# EAGLE board XMICRO-6502 V2.4 (EAGLE 6.3), part 1 of 2
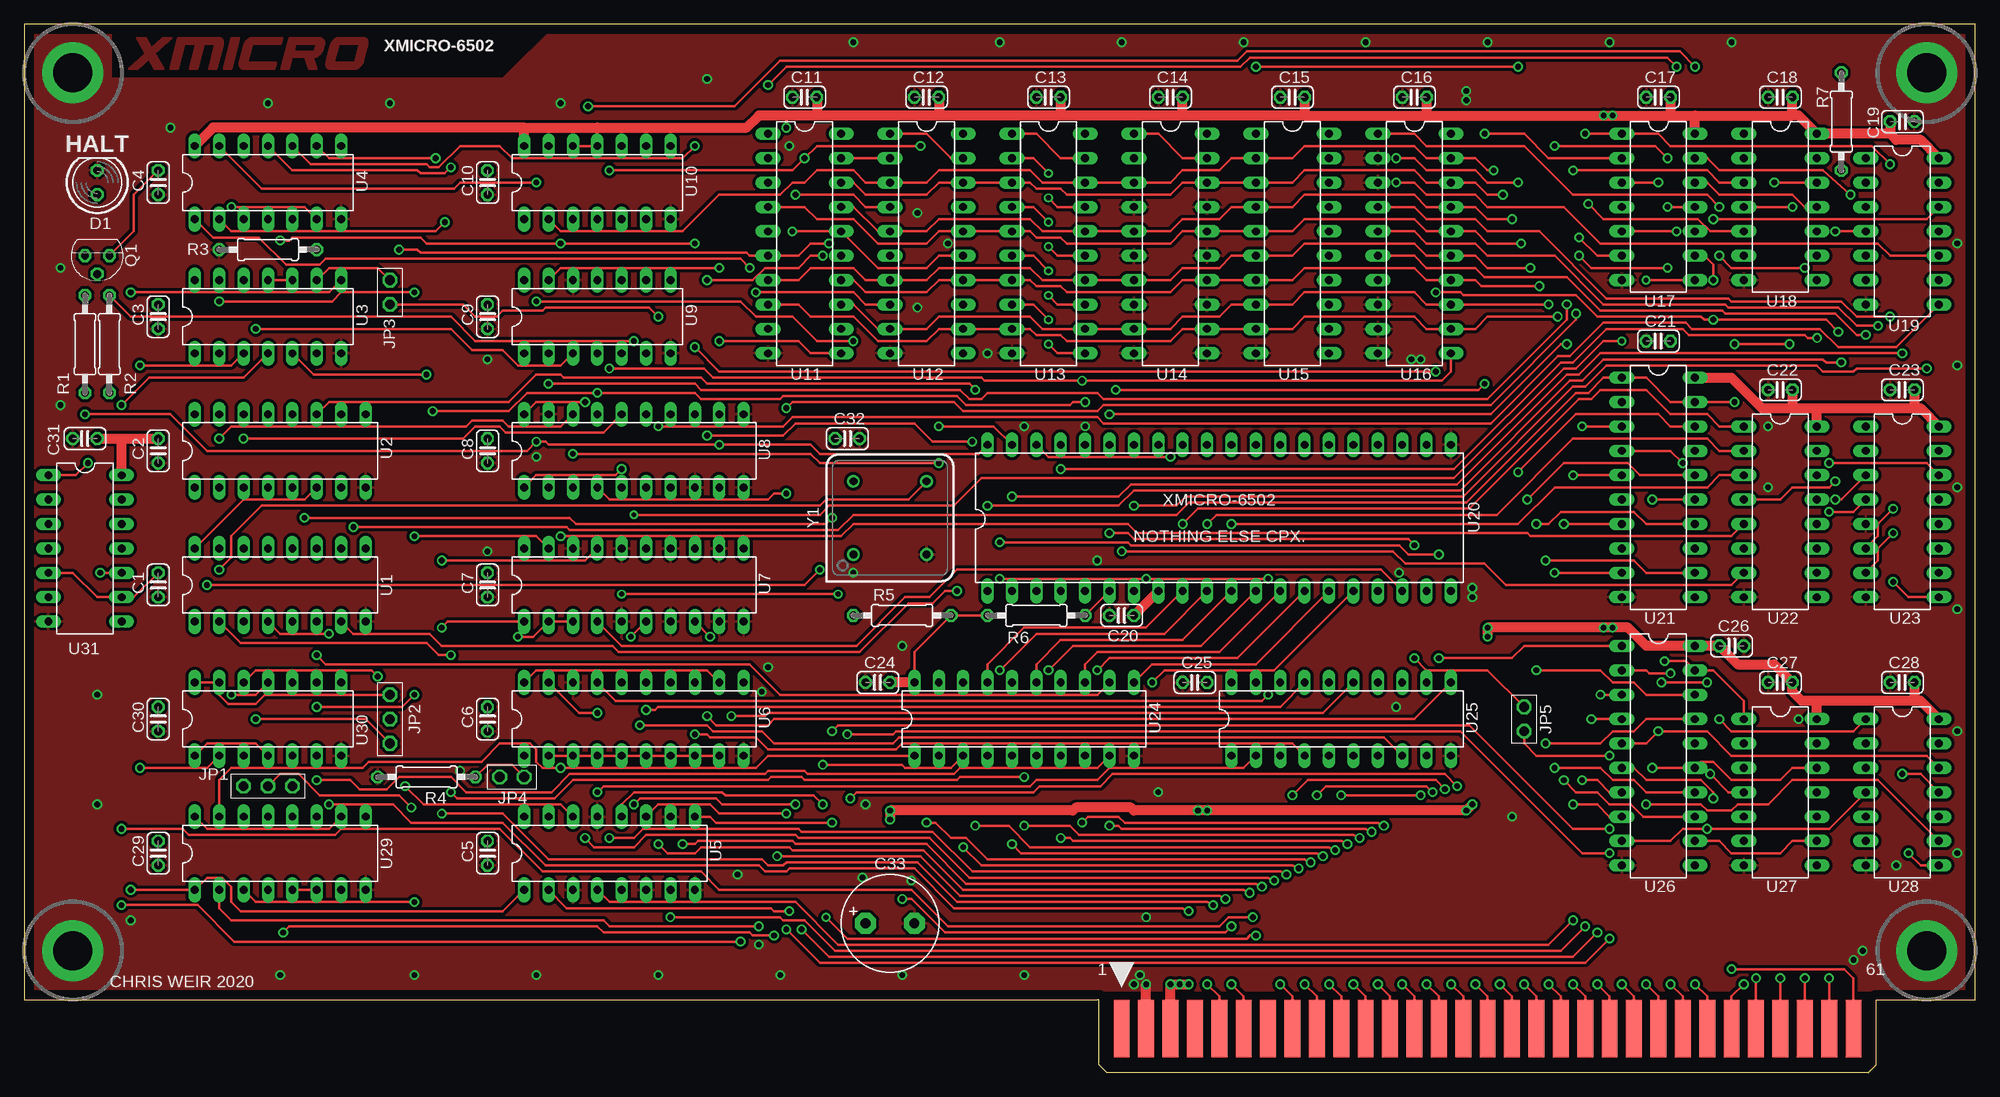
[diagram p6: board, top side]
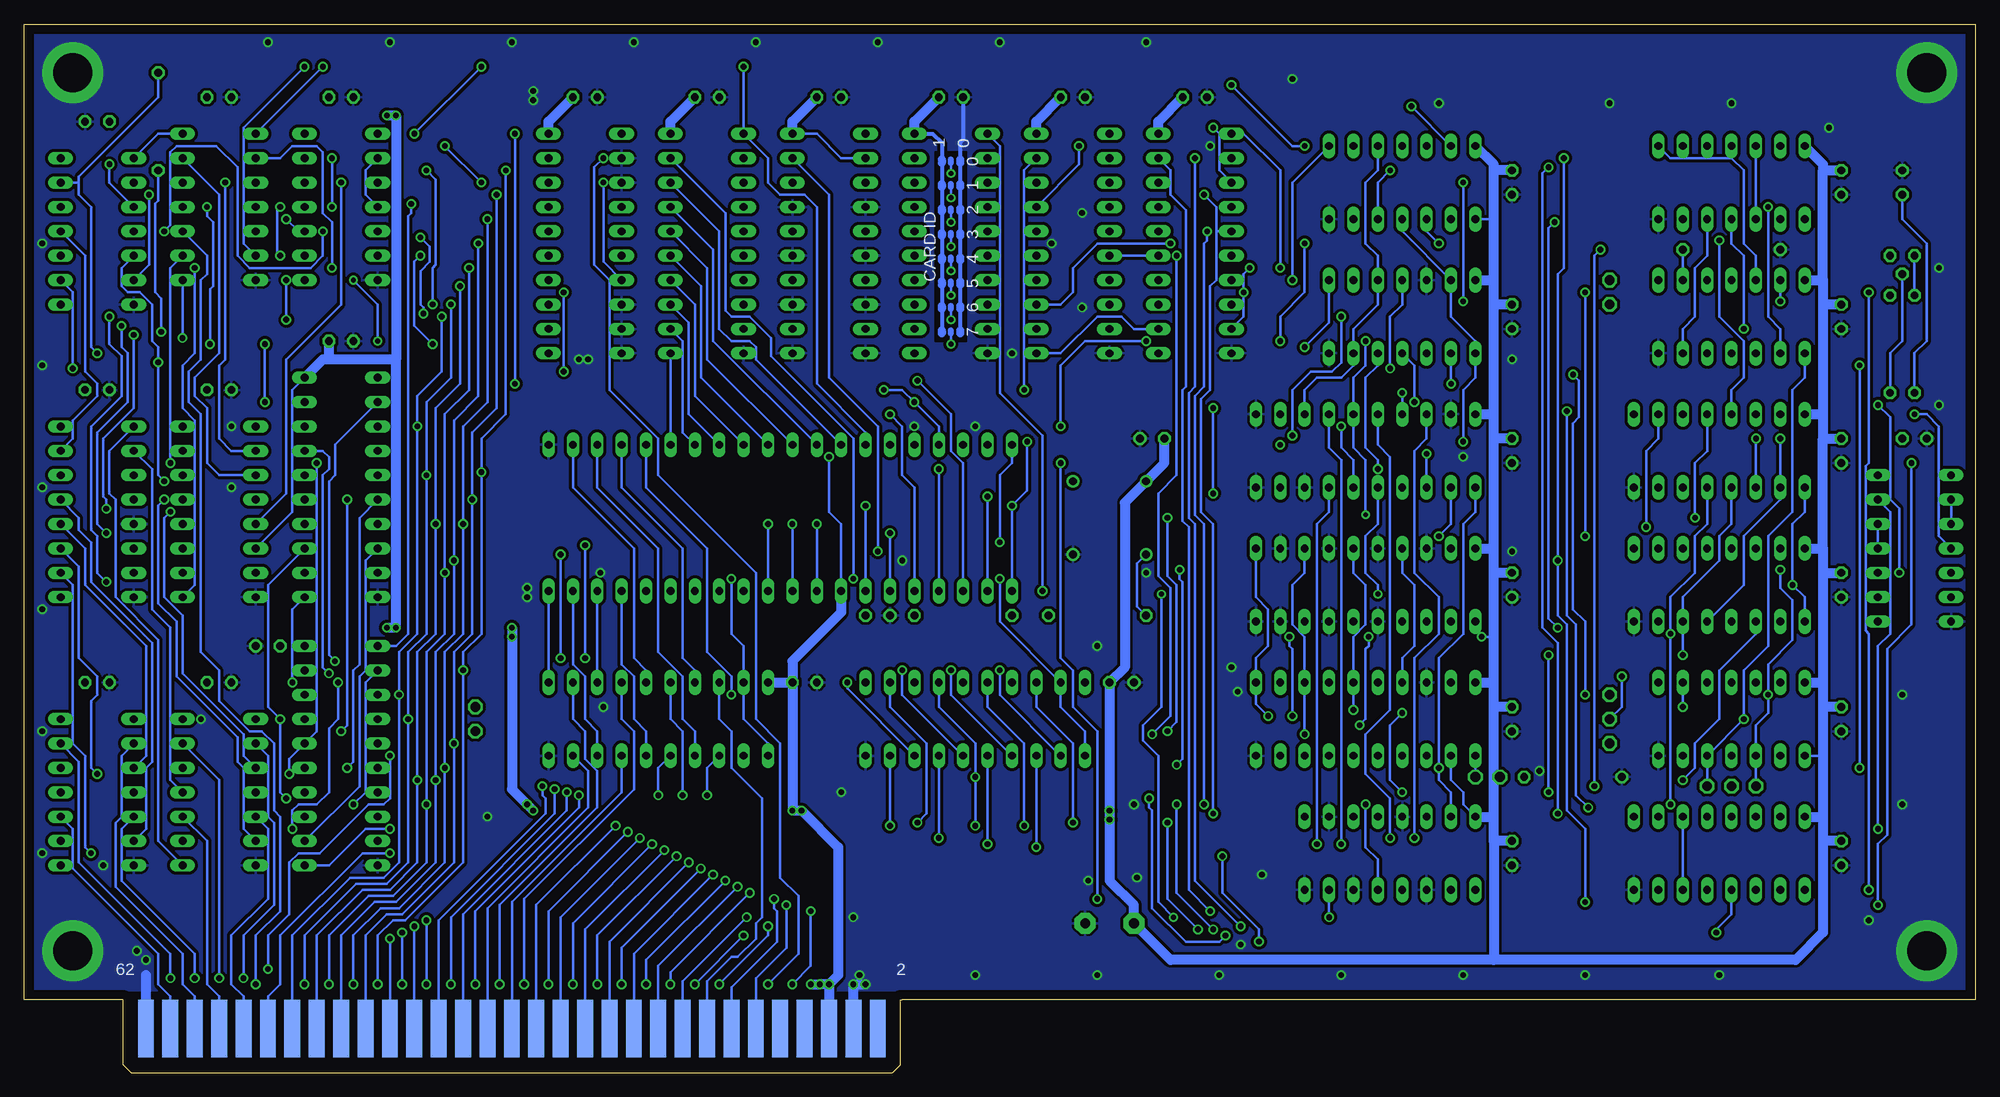
[diagram p7: board, bottom side, seen from below]

Size 203.2 x 109.22 mm. Coordinates in mm from the lower left corner, seen from the top.
Outline: 111.76,7.62 0,7.62 0,109.22 203.2,109.22 203.2,7.62 193.04,7.62
Copper layers (1*16): Top 0.035mm / dielectric 1.5mm / Bottom 0.035mm
Design rules "default *": minimum track width 10mil, minimum drill 0.3mm, track to track 10mil, track to pad 10mil, pad to pad 10mil, via to via 10mil, smd to smd 10mil, copper to edge 40mil, drill to drill 10mil, minimum pad ring 10mil, minimum via ring 8mil, stop-mask expansion 4mil, vias tented up to drill 100mil, thermal gap 10mil
Net classes: 1 GND: width 0.254 mm, clearance 0.305 mm
bRestrict: area 105.1,76.2 to 108.3,95.9

## Footprints (pad centres in the part's own frame; a part is rotated, then mirrored left to right if it is on the bottom)
C025-024X044 = drill 0.813 octagon: 1 -1.27,0; 2 1.27,0
C-10-5 = drill 1.016 pad 2.184 octagon: + -2.54,0; - 2.54,0
LED5MM = drill 0.813 octagon: A -1.27,0; K 1.27,0
1X03 = drill 1.016 octagon: 1 -2.54,0; 2 0,0; 3 2.54,0
1X02 = drill 1.016 octagon: 1 -1.27,0; 2 1.27,0
EDGE62M = smd 1.651 x 5.969: 1 -38.1,-3.01; 3 -35.56,-3.01; 5 -33.02,-3.01; 7 -30.48,-3.01; 9 -27.94,-3.01; 11 -25.4,-3.01; 13 -22.86,-3.01; 15 -20.32,-3.01; 17 -17.78,-3.01; 19 -15.24,-3.01; 21 -12.7,-3.01; 23 -10.16,-3.01; 25 -7.62,-3.01; 27 -5.08,-3.01; 29 -2.54,-3.01; 31 0,-3.01; 33 2.54,-3.01; 35 5.08,-3.01; 37 7.62,-3.01; 39 10.16,-3.01; 41 12.7,-3.01; 43 15.24,-3.01; 45 17.78,-3.01; 47 20.32,-3.01; 49 22.86,-3.01; 51 25.4,-3.01; 53 27.94,-3.01; 55 30.48,-3.01; 57 33.02,-3.01; 59 35.56,-3.01; 61 38.1,-3.01 | smd 1.651 x 5.969 bottom: 2 -38.1,-3.01; 4 -35.56,-3.01; 6 -33.02,-3.01; 8 -30.48,-3.01; 10 -27.94,-3.01; 12 -25.4,-3.01; 14 -22.86,-3.01; 16 -20.32,-3.01; 18 -17.78,-3.01; 20 -15.24,-3.01; 22 -12.7,-3.01; 24 -10.16,-3.01; 26 -7.62,-3.01; 28 -5.08,-3.01; 30 -2.54,-3.01; 32 0,-3.01; 34 2.54,-3.01; 36 5.08,-3.01; 38 7.62,-3.01; 40 10.16,-3.01; 42 12.7,-3.01; 44 15.24,-3.01; 46 17.78,-3.01; 48 20.32,-3.01; 50 22.86,-3.01; 52 25.4,-3.01; 54 27.94,-3.01; 56 30.48,-3.01; 58 33.02,-3.01; 60 35.56,-3.01; 62 38.1,-3.01
TO92 = drill 0.813 octagon: 1 -1.27,0; 2 0,1.905; 3 1.27,0
0207/10 = drill 0.813 octagon: 1 -5.08,0; 2 5.08,0
DIL16 = drill 0.813 long: 1 -8.89,-3.81; 2 -6.35,-3.81; 3 -3.81,-3.81; 4 -1.27,-3.81; 5 1.27,-3.81; 6 3.81,-3.81; 7 6.35,-3.81; 8 8.89,-3.81; 9 8.89,3.81; 10 6.35,3.81; 11 3.81,3.81; 12 1.27,3.81; 13 -1.27,3.81; 14 -3.81,3.81; 15 -6.35,3.81; 16 -8.89,3.81
DIL14 = drill 0.813 long: 1 -7.62,-3.81; 2 -5.08,-3.81; 3 -2.54,-3.81; 4 0,-3.81; 5 2.54,-3.81; 6 5.08,-3.81; 7 7.62,-3.81; 8 7.62,3.81; 9 5.08,3.81; 10 2.54,3.81; 11 0,3.81; 12 -2.54,3.81; 13 -5.08,3.81; 14 -7.62,3.81
DIL20 = drill 0.813 long: 1 -11.43,-3.81; 2 -8.89,-3.81; 3 -6.35,-3.81; 4 -3.81,-3.81; 5 -1.27,-3.81; 6 1.27,-3.81; 7 3.81,-3.81; 8 6.35,-3.81; 9 8.89,-3.81; 10 11.43,-3.81; 11 11.43,3.81; 12 8.89,3.81; 13 6.35,3.81; 14 3.81,3.81; 15 1.27,3.81; 16 -1.27,3.81; 17 -3.81,3.81; 18 -6.35,3.81; 19 -8.89,3.81; 20 -11.43,3.81
DIL40 = drill 0.813 long: 1 -24.13,-7.62; 2 -21.59,-7.62; 3 -19.05,-7.62; 4 -16.51,-7.62; 5 -13.97,-7.62; 6 -11.43,-7.62; 7 -8.89,-7.62; 8 -6.35,-7.62; 9 -3.81,-7.62; 10 -1.27,-7.62; 11 1.27,-7.62; 12 3.81,-7.62; 13 6.35,-7.62; 14 8.89,-7.62; 15 11.43,-7.62; 16 13.97,-7.62; 17 16.51,-7.62; 18 19.05,-7.62; 19 21.59,-7.62; 20 24.13,-7.62; 21 24.13,7.62; 22 21.59,7.62; 23 19.05,7.62; 24 16.51,7.62; 25 13.97,7.62; 26 11.43,7.62; 27 8.89,7.62; 28 6.35,7.62; 29 3.81,7.62; 30 1.27,7.62; 31 -1.27,7.62; 32 -3.81,7.62; 33 -6.35,7.62; 34 -8.89,7.62; 35 -11.43,7.62; 36 -13.97,7.62; 37 -16.51,7.62; 38 -19.05,7.62; 39 -21.59,7.62; 40 -24.13,7.62
DIL08S = drill 0.813: 1 -3.81,-3.81; 4 3.81,-3.81; 5 3.81,3.81; 8 -3.81,3.81

## Placement (x,y rotation side)
C1  0.1uF  [C025-024X044]  13.97,50.8 270 top
C2  0.1uF  [C025-024X044]  13.97,64.77 270 top
C3  0.1uF  [C025-024X044]  13.97,78.74 270 top
C4  0.1uF  [C025-024X044]  13.97,92.71 270 top
C5  0.1uF  [C025-024X044]  48.26,22.86 270 top
C6  0.1uF  [C025-024X044]  48.26,36.83 270 top
C7  0.1uF  [C025-024X044]  48.26,50.8 270 top
C8  0.1uF  [C025-024X044]  48.26,64.77 270 top
C9  0.1uF  [C025-024X044]  48.26,78.74 270 top
C10  0.1uF  [C025-024X044]  48.26,92.71 270 top
C11  0.1uF  [C025-024X044]  81.28,101.6 180 top
C12  0.1uF  [C025-024X044]  93.98,101.6 180 top
C13  0.1uF  [C025-024X044]  106.68,101.6 180 top
C14  0.1uF  [C025-024X044]  119.38,101.6 180 top
C15  0.1uF  [C025-024X044]  132.08,101.6 180 top
C16  0.1uF  [C025-024X044]  144.78,101.6 180 top
C17  0.1uF  [C025-024X044]  170.18,101.6 180 top
C18  0.1uF  [C025-024X044]  182.88,101.6 180 top
C19  0.1uF  [C025-024X044]  195.58,99.06 0 top
C20  0.1uF  [C025-024X044]  114.3,47.62 180 top
C21  0.1uF  [C025-024X044]  170.18,76.2 180 top
C22  0.1uF  [C025-024X044]  182.88,71.12 180 top
C23  0.1uF  [C025-024X044]  195.58,71.12 180 top
C24  0.1uF  [C025-024X044]  88.9,40.64 180 top
C25  0.1uF  [C025-024X044]  121.92,40.64 180 top
C26  0.1uF  [C025-024X044]  177.8,44.45 0 top
C27  0.1uF  [C025-024X044]  182.88,40.64 180 top
C28  0.1uF  [C025-024X044]  195.58,40.64 180 top
C29  0.1uF  [C025-024X044]  13.97,22.86 270 top
C30  0.1uF  [C025-024X044]  13.97,36.83 270 top
C31  0.1uF  [C025-024X044]  6.35,66.04 180 top
C32  0.1uF  [C025-024X044]  85.72,66.04 0 top
C33  470uF  [C-10-5]  90.17,15.56 0 top
D1  RED  [LED5MM]  7.62,92.71 90 top
JP1  PINHD1X3THRU  [1X03]  25.4,29.85 180 top
JP2  PINHD1X3THRU  [1X03]  38.1,36.83 270 top
JP3  PINHD-1X2THRU  [1X02]  38.1,81.28 270 top
JP4  PINHD-1X2THRU  [1X02]  50.8,30.8 0 top
JP5  PINHD-1X2THRU  [1X02]  156.21,36.83 90 top
PC0  XMICRO-BUS-EDGE62M  [EDGE62M]  152.4,7.62 0 top
Q1  2N4403  [TO92]  7.62,85.09 180 top
R1  270  [0207/10]  6.35,75.88 90 top
R2  22k  [0207/10]  8.89,75.88 270 top
R3  10k  [0207/10]  25.4,85.73 180 top
R4  10k  [0207/10]  41.91,30.8 180 top
R5  10k  [0207/10]  91.44,47.62 0 top
R6  10k  [0207/10]  105.41,47.62 180 top
R7  470  [0207/10]  189.23,99.06 270 top
U1  74138  [DIL16]  26.67,50.8 0 top
U2  74138  [DIL16]  26.67,64.77 0 top
U3  7400  [DIL14]  25.4,78.74 0 top
U4  7404  [DIL14]  25.4,92.71 0 top
U5  74257  [DIL16]  60.96,22.86 0 top
U6  74688  [DIL20]  63.5,36.83 0 top
U7  74688  [DIL20]  63.5,50.8 0 top
U8  74244  [DIL20]  63.5,64.77 0 top
U9  7474  [DIL14]  59.69,78.74 0 top
U10  7474  [DIL14]  59.69,92.71 0 top
U11  74273  [DIL20]  81.28,86.36 270 top
U12  74244  [DIL20]  93.98,86.36 270 top
U13  74244  [DIL20]  106.68,86.36 270 top
U14  74244  [DIL20]  119.38,86.36 270 top
U15  74245  [DIL20]  132.08,86.36 270 top
U16  74574  [DIL20]  144.78,86.36 270 top
U17  7400  [DIL14]  170.18,90.17 270 top
U18  7408  [DIL14]  182.88,90.17 270 top
U19  7404  [DIL14]  195.58,87.63 270 top
U20  W65C02S  [DIL40]  124.46,57.78 0 top
U21  74244  [DIL20]  170.18,60.96 270 top
U22  74138  [DIL16]  182.88,58.42 270 top
U23  74148  [DIL16]  195.58,58.42 270 top
U24  74244  [DIL20]  104.14,36.83 0 top
U25  74244  [DIL20]  137.16,36.83 0 top
U26  74273  [DIL20]  170.18,33.02 270 top
U27  7432  [DIL14]  182.88,29.21 270 top
U28  7432  [DIL14]  195.58,29.21 270 top
U29  74257  [DIL16]  26.67,22.86 0 top
U30  7474  [DIL14]  25.4,36.83 0 top
U31  74LS14N  [DIL14]  6.35,54.61 270 top
Y1  12MHz  [DIL08S]  90.17,57.78 0 top